# Altium schematic sheet Sheet1.SchDoc
size A; SheetNumber: 1; SheetTotal: 1
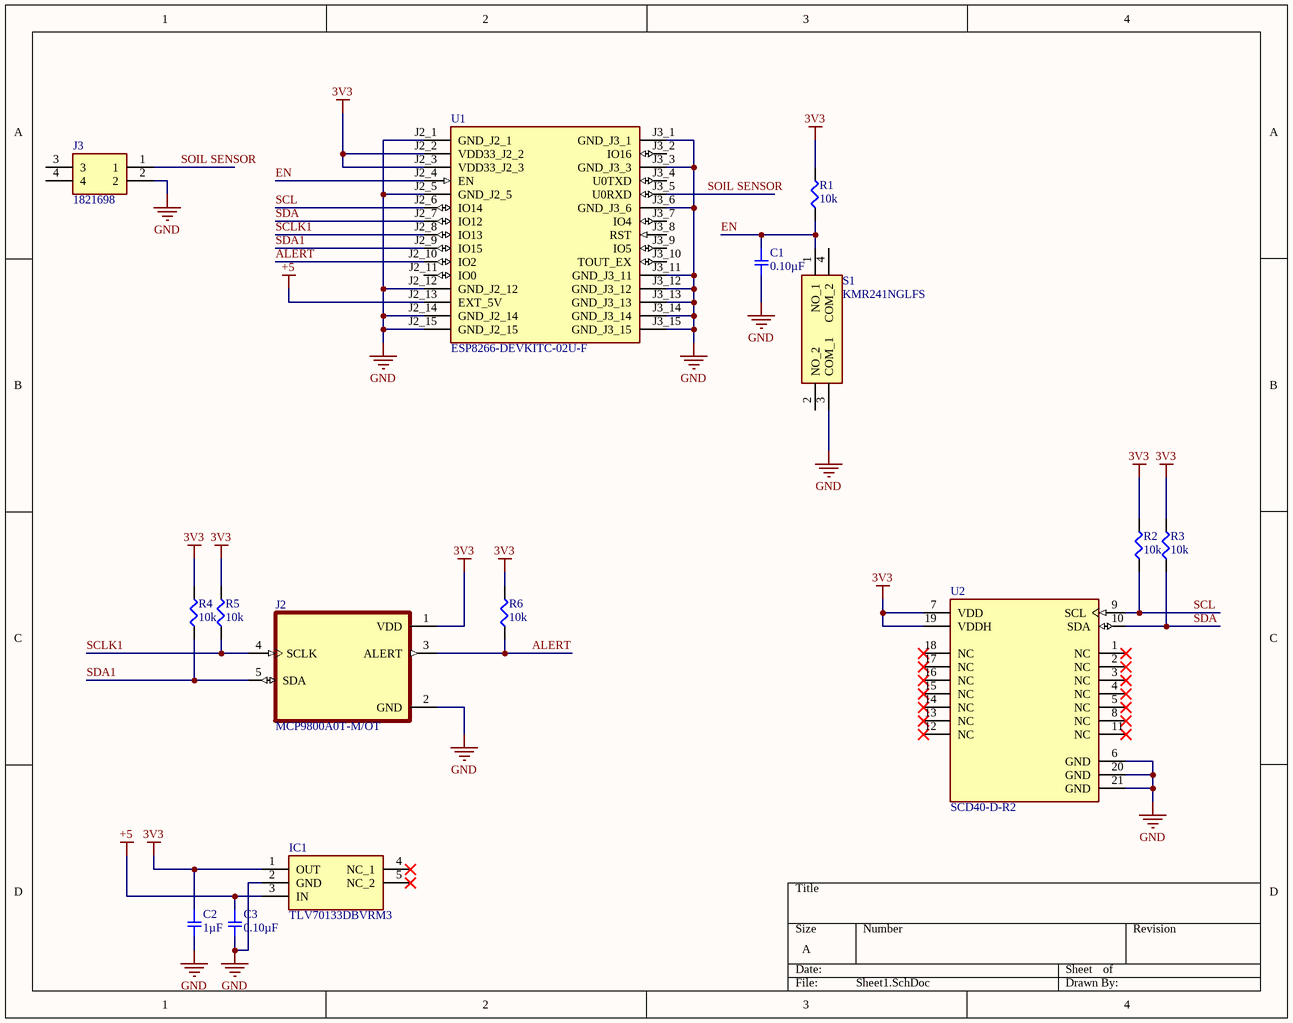
[diagram p0: Sheet1.SchDoc]

## Parts
C1  0.10µF  [SMD-0402C]
C2  1µF  [SMD-0402C]
C3  0.10µF  [SMD-0402C]
IC1  TLV70133DBVRM3  [SOT95P280X145-5N]
J2  MCP9800A0T-M/OT  [SOT95P270X145-5N]
J3  1821698  [1821698]
R1  10k  [SMD-0402-RES]
R2  10k  [SMD-0402-RES]
R3  10k  [SMD-0402-RES]
R4  10k  [SMD-0402-RES]
R5  10k  [SMD-0402-RES]
R6  10k  [SMD-0402-RES]
S1  KMR241NGLFS  [KMR241NGLFS]
U1  ESP8266-DEVKITC-02U-F  [MODULE_ESP8266-DEVKITC-02U-F]
U2  SCD40-D-R2  [FP-SCD40-D-R2-MFG]

## Nets
3V3: C2.1 IC1.1(OUT) J2.1(VDD) R1.2 R2.2 R3.2 R4.2 R5.2 R6.2 U1.J2_2(VDD33_J2_2) U1.J2_3(VDD33_J2_3) U2.7(VDD) U2.19(VDDH)
+5: C3.1 IC1.3(IN) U1.J2_13(EXT_5V)
GND: C1.2 C2.2 C3.2 IC1.2(GND) J2.2(GND) J3.2 S1.3(COM_1) U1.J2_1(GND_J2_1) U1.J2_5(GND_J2_5) U1.J2_12(GND_J2_12) U1.J2_14(GND_J2_14) U1.J2_15(GND_J2_15) U1.J3_1(GND_J3_1) U1.J3_3(GND_J3_3) U1.J3_6(GND_J3_6) U1.J3_11(GND_J3_11) U1.J3_12(GND_J3_12) U1.J3_13(GND_J3_13) U1.J3_14(GND_J3_14) U1.J3_15(GND_J3_15) U2.6(GND) U2.20(GND) U2.21(GND)
ALERT: J2.3(ALERT) R6.1 U1.J2_10(IO2)
EN: C1.1 R1.1 S1.1(NO_1) U1.J2_4(EN)
SCL: R2.1 U1.J2_6(IO14) U2.9(SCL)
SCLK1: J2.4(SCLK) R5.1 U1.J2_8(IO13)
SDA: R3.1 U1.J2_7(IO12) U2.10(SDA)
SDA1: J2.5(SDA) R4.1 U1.J2_9(IO15)
SOIL SENSOR: J3.1 U1.J3_5(U0RXD)

Not connected (* = marked no-connect by the designer): IC1 4(NC_1)* 5(NC_2)*; J3 3 4; S1 2(NO_2) 4(COM_2); U1 J2_11(IO0) J3_2(IO16) J3_4(U0TXD) J3_7(IO4) J3_8(RST) J3_9(IO5) J3_10(TOUT_EX); U2 1(NC)* 2(NC)* 3(NC)* 4(NC)* 5(NC)* 8(NC)* 11(NC)* 12(NC)* 13(NC)* 14(NC)* 15(NC)* 16(NC)* 17(NC)* 18(NC)*

## Library data of the parts
C1 C3 = GCM155R71C104KA55D: CAP CER 0.1UF 16V X7R 0402; Manufacturer: Murata Electronics North America; Factory Stock: 0; Unit Price (USD): 0.1; Minimum Quantity: 1; Tolerance: ±10%; Datasheets: http://www.murata.com/~/media/webrenewal/support/library/catalog/products/capacitor/mlcc/c03e.ashx; Image: //media.digikey.com/Renders/Murata%20Renders/ZRB-SERIES-0402.jpg; Digi-Key Part Number: 490-4759-1-ND; Part Number: GCM155R71C104KA55D; Quantity Available: 734194; @ qty: 0; Packaging: Cut Tape (CT); Series: GCM; Part Status: Active; Value: 0.10µF; Voltage: 16V; Temperature Coefficient: X7R; Operating Temperature: -55°C ~ 125°C; Features: -; Ratings: AEC-Q200; Applications: Automotive; Mounting Type: Surface Mount, MLCC; Package / Case: 0402 (1005 Metric); Size / Dimension: 0.039" L x 0.020" W (1.00mm x 0.50mm); Height - Seated (Max): -; Thickness (Max): 0.022" (0.55mm); Lead Spacing: -; Lead Style: -
C2 = GRM155C81C105KE11D: CAP CER 1UF 16V X6S 0402; Manufacturer: Murata Electronics North America; Factory Stock: 0; Unit Price (USD): 0.29; Minimum Quantity: 1; Tolerance: ±10%; Datasheets: http://www.murata.com/~/media/webrenewal/support/library/catalog/products/capacitor/mlcc/c02e.pdf; Image: //media.digikey.com/Renders/Murata%20Renders/ZRB-SERIES-0402.jpg; Digi-Key Part Number: 490-12700-1-ND; Part Number: GRM155C81C105KE11D; Quantity Available: 37242; @ qty: 0; Packaging: Cut Tape (CT); Series: GRM; Part Status: Active; Value: 1µF; Voltage: 16V; Temperature Coefficient: X6S; Operating Temperature: -55°C ~ 105°C; Features: -; Ratings: -; Applications: General Purpose; Mounting Type: Surface Mount, MLCC; Package / Case: 0402 (1005 Metric); Size / Dimension: 0.039" L x 0.020" W (1.00mm x 0.50mm); Height - Seated (Max): -; Thickness (Max): 0.024" (0.60mm); Lead Spacing: -; Lead Style: -
IC1 = TLV70133DBVRM3: Integrated Circuit; Manufacturer_Name: Texas Instruments; Datasheet Link: https://www.ti.com/lit/ds/symlink/tlv701.pdf?ts=1700390898470&ref_url=https%253A%252F%252Fwww.ti.com%252Fsitesearch%252Fen-us%252Fdocs%252Funiversalsearch.tsp%253FlangPref%253Den-US%2526searchTerm%253DTLV70133DBVRM3%2526nr%253D3; Height: 1.45mm; Manufacturer_Part_Number: TLV70133DBVRM3; Mouser Part Number: 595-TLV70133DBVRM3; Mouser Price/Stock: https://www.mouser.co.uk/ProductDetail/Texas-Instruments/TLV70133DBVRM3?qs=3Rah4i%252BhyCHU3ffU4PTMcA%3D%3D
J2 = MCP9800A0T-M/OT: MF: {'manufacturer': u'Microchip Technology'}; Package: None; Price: None; Value: *; MP: MCP9800A0T-M/OT; Availability: Unavailable
J3 = 1821698: Connector; Manufacturer_Name: Phoenix Contact; Datasheet Link: http://www.phoenixcontact.com/gb/produkte/1821698; Height: 4.95mm; Manufacturer_Part_Number: 1821698; Mouser Part Number: 651-1821698; Mouser Price/Stock: https://www.mouser.co.uk/ProductDetail/Phoenix-Contact/1821698?qs=2WS7V4AoKFr7rSFtXkjbWA%3D%3D; Arrow Part Number: 1821698; Arrow Price/Stock: https://www.arrow.com/en/products/1821698/phoenix-contact
R1-R6 = ERJ-2GEJ103X: RES SMD 10K OHM 5% 1/10W 0402; Manufacturer: Panasonic Electronic Components; Factory Stock: 0; Unit Price (USD): 0.00350; @ qty: 1500; Minimum Quantity: 1; Power (Watts): 0.1W, 1/10W; Temperature Coefficient: ±200ppm/°C; Part Number: ERJ-2GEJ103X; Datasheets: http://industrial.panasonic.com/www-cgi/jvcr13pz.cgi?E+PZ+3+AOA0001+ERJ2GEJ103X+7+WW; Image: //media.digikey.com/Photos/Panasonic%20Photos/ERJ-PA2-Series.jpg; Digi-Key Part Number: P10KJCT-ND; Quantity Available: 2560215; Packaging: Cut Tape (CT); Series: ERJ; Part Status: Active; Value: 10k; Tolerance: ±5%; Composition: Thick Film; Features: Automotive AEC-Q200; Operating Temperature: -55°C ~ 155°C; Package / Case: 0402 (1005 Metric); Supplier Device Package: 0402; Size / Dimension: 0.039" L x 0.020" W (1.00mm x 0.50mm); Height - Seated (Max): 0.016" (0.40mm); Number of Terminations: 2; Failure Rate: -
S1 = KMR241NGLFS: Switch; Manufacturer_Name: C & K COMPONENTS; Datasheet Link: https://www.ckswitches.com/media/1479/kmr2.pdf; Height: 1.9mm; Manufacturer_Part_Number: KMR241NGLFS; Mouser Part Number: 611-KMR241NGLFS; Mouser Price/Stock: https://www.mouser.co.uk/ProductDetail/CK/KMR241NGLFS?qs=sb%252But3Lm4x3MOq2auuFbeg%3D%3D; Arrow Part Number: KMR241NGLFS; Arrow Price/Stock: https://www.arrow.com/en/products/kmr241nglfs/ck
U1 = ESP8266-DEVKITC-02U-F: MF: {'manufacturer': u'Espressif Systems'}; Package: None; Price: None; Value: *; MP: ESP8266-DEVKITC-02U-F; Availability: Unavailable
U2 = CMP-144026-000006-1: CO2 SENSOR 50 PPM I2C SMD